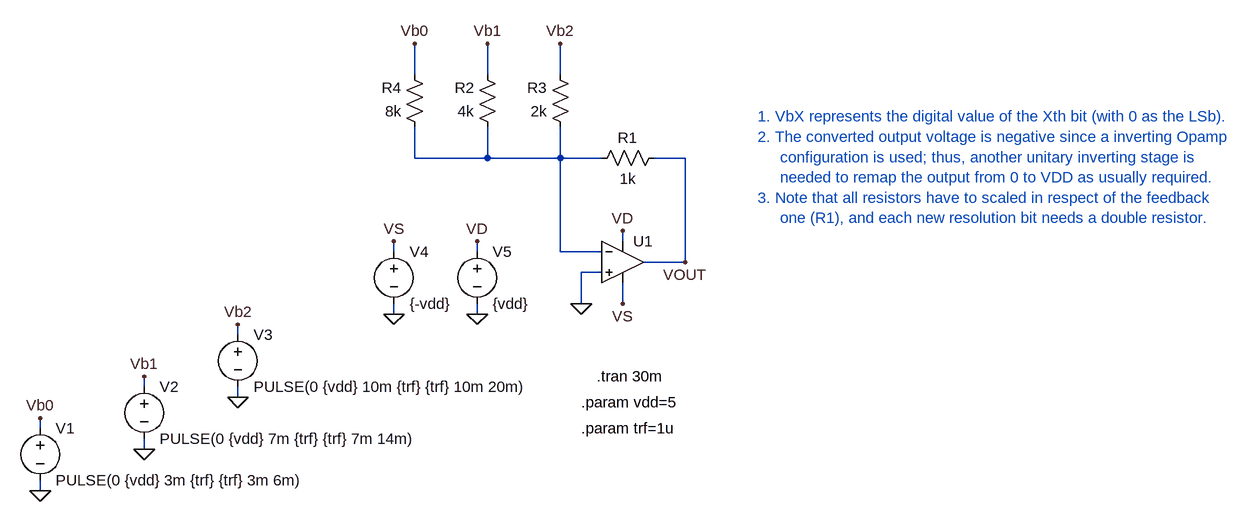
[diagram p0: schematic R2R_Ladder_DAC.asc]
R2R_Ladder_DAC.asc, the LTspice schematic file:
Version 4
SHEET 1 1524 680
WIRE 32 -64 32 -112
WIRE 144 -64 144 -112
WIRE 256 -64 256 -112
WIRE 32 64 32 16
WIRE 144 64 144 16
WIRE 144 64 32 64
WIRE 256 64 256 16
WIRE 256 64 144 64
WIRE 320 64 256 64
WIRE 448 64 400 64
WIRE 352 192 352 176
WIRE 0 208 0 192
WIRE 128 208 128 192
WIRE 256 208 256 64
WIRE 320 208 256 208
WIRE 448 224 448 64
WIRE 448 224 384 224
WIRE 320 240 288 240
WIRE 288 288 288 240
WIRE 352 288 352 256
WIRE 0 304 0 288
WIRE 128 304 128 288
WIRE -240 336 -240 320
WIRE -384 416 -384 400
WIRE -240 432 -240 416
WIRE -544 480 -544 464
WIRE -384 512 -384 496
WIRE -544 576 -544 560
FLAG 352 176 VD
FLAG -240 432 0
FLAG 448 224 VOUT
FLAG 128 304 0
FLAG 128 192 VD
FLAG 0 304 0
FLAG 0 192 VS
FLAG 352 288 VS
FLAG 288 288 0
FLAG 256 -112 Vb2
FLAG 144 -112 Vb1
FLAG 32 -112 Vb0
FLAG -384 512 0
FLAG -544 576 0
FLAG -240 320 Vb2
FLAG -384 400 Vb1
FLAG -544 464 Vb0
SYMBOL OpAmps\\UniversalOpamp2 352 224 R0
SYMATTR InstName U1
SYMBOL res 416 48 R90
WINDOW 0 0 56 VBottom 2
WINDOW 3 32 56 VTop 2
SYMATTR InstName R1
SYMATTR Value 1k
SYMBOL res 160 32 R180
WINDOW 0 36 76 Left 2
WINDOW 3 36 40 Left 2
SYMATTR InstName R2
SYMATTR Value 4k
SYMBOL res 272 32 R180
WINDOW 0 36 76 Left 2
WINDOW 3 36 40 Left 2
SYMATTR InstName R3
SYMATTR Value 2k
SYMBOL voltage -240 320 R0
WINDOW 123 0 0 Left 0
WINDOW 39 0 0 Left 0
SYMATTR InstName V3
SYMATTR Value PULSE(0 {vdd} 10m {trf} {trf} 10m 20m)
SYMBOL voltage -384 400 R0
WINDOW 123 0 0 Left 0
WINDOW 39 0 0 Left 0
SYMATTR InstName V2
SYMATTR Value PULSE(0 {vdd} 7m {trf} {trf} 7m 14m)
SYMBOL voltage 128 192 R0
WINDOW 123 0 0 Left 0
WINDOW 39 0 0 Left 0
SYMATTR InstName V5
SYMATTR Value {vdd}
SYMBOL res 48 32 R180
WINDOW 0 36 76 Left 2
WINDOW 3 36 40 Left 2
SYMATTR InstName R4
SYMATTR Value 8k
SYMBOL voltage 0 192 R0
WINDOW 123 0 0 Left 0
WINDOW 39 0 0 Left 0
SYMATTR InstName V4
SYMATTR Value {-vdd}
SYMBOL voltage -544 464 R0
WINDOW 123 0 0 Left 0
WINDOW 39 0 0 Left 0
SYMATTR InstName V1
SYMATTR Value PULSE(0 {vdd} 3m {trf} {trf} 3m 6m)
TEXT 312 400 Left 2 !.tran 30m
TEXT 288 440 Left 2 !.param vdd=5
TEXT 288 480 Left 2 !.param trf=1u
TEXT 560 0 Left 2 ;1. VbX represents the digital value of the Xth bit (with 0 as the LSb).\n2. The converted output voltage is negative since a inverting Opamp\n     configuration is used; thus, another unitary inverting stage is\n     needed to remap the output from 0 to VDD as usually required.\n3. Note that all resistors have to scaled in respect of the feedback\n     one (R1), and each new resolution bit needs a double resistor.

The netlist it stands for:
* R2R_Ladder_DAC.asc
XU1 0 N001 VD VS VOUT level.2 Avol=1Meg GBW=10Meg Slew=10Meg ilimit=25m rail=0 Vos=0 phimargin=45 en=0 enk=0 in=0 ink=0 Rin=500Meg  ; pins IN+ IN- V+ V- OUT
R1 VOUT N001 1k
R2 N001 Vb1 4k
R3 N001 Vb2 2k
V3 Vb2 0 PULSE(0 {vdd} 10m {trf} {trf} 10m 20m)
V2 Vb1 0 PULSE(0 {vdd} 7m {trf} {trf} 7m 14m)
V5 VD 0 {vdd}
R4 N001 Vb0 8k
V4 VS 0 {-vdd}
V1 Vb0 0 PULSE(0 {vdd} 3m {trf} {trf} 3m 6m)
.tran 30m
.param vdd=5
.param trf=1u
* 1. VbX represents the digital value of the Xth bit (with 0 as the LSb).
* 2. The converted output voltage is negative since a inverting Opamp
*      configuration is used; thus, another unitary inverting stage is
*      needed to remap the output from 0 to VDD as usually required.
* 3. Note that all resistors have to scaled in respect of the feedback
*      one (R1), and each new resolution bit needs a double resistor.
.lib UniversalOpamps2.sub
.backanno
.end